# Altium schematic sheet Weight Schematic.SchDoc
size A4
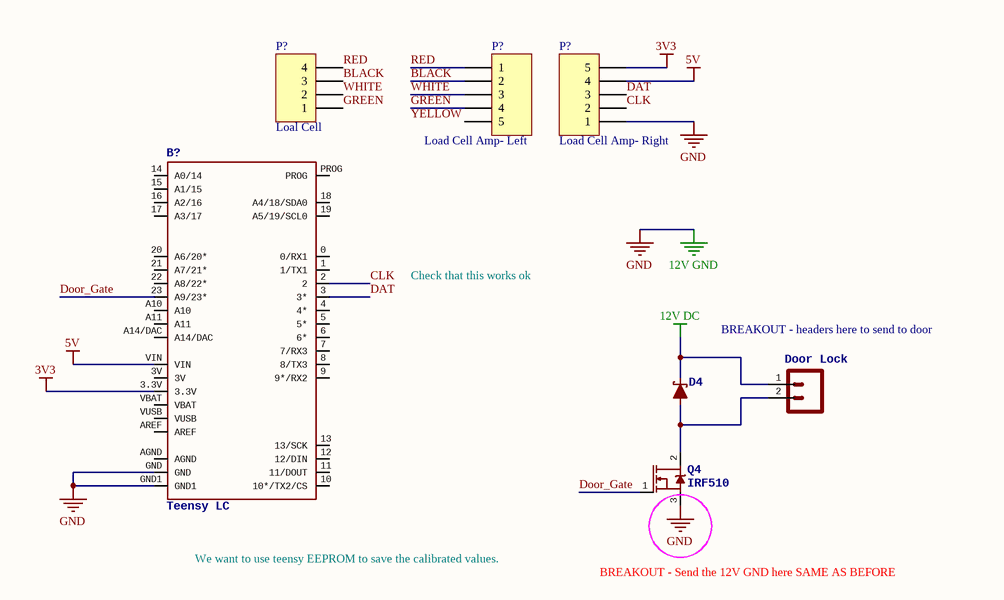
[diagram p0: Weight Schematic.SchDoc]

## Parts
(Parts that share a designator on the sheet are numbered #1, #2 ... from top to bottom, then left to right.)
B?  Teensy LC  [TEENSY-3.1]
D4  (no value)  [SOD-323]
Door_Lock  (no value)  [1X02_LOCK]
P?#1  Load Cell Amp- Left  [HDR1X5]
P?#2  Loal Cell  [HDR1X4]
P?#3  Load Cell Amp- Right  [HDR1X5]
Q4  IRF510  [TO220V]

## Nets
3V3: B?.3.3V P?#3.5
5V: B?.VIN P?#3.4
12V DC: D4.C Door_Lock.1
12V GND: B?.GND B?.GND1 P?#3.1 Q4.3(S)  [also labelled GND]
BLACK: P?#1.2 P?#2.3
CLK: B?.2 P?#3.2
DAT: B?.3(3*) P?#3.3
Door_Gate: B?.23(A9/23*) Q4.1(G)
GREEN: P?#1.4 P?#2.1
RED: P?#1.1 P?#2.4
WHITE: P?#1.3 P?#2.2
NetD4_A: D4.A Door_Lock.2 Q4.2(D)

Not connected (* = marked no-connect by the designer): B? 0(0/RX1) 1(1/TX1) 3V 4(4*) 5(5*) 6(6*) 7(7/RX3) 8(8/TX3) 9(9*/RX2) 10(10*/TX2/CS) 11(11/DOUT) 12(12/DIN) 13(13/SCK) 14(A0/14) 15(A1/15) 16(A2/16) 17(A3/17) 18(A4/18/SDA0) 19(A5/19/SCL0) 20(A6/20*) 21(A7/21*) 22(A8/22*) A10 A11 A14/DAC AGND AREF PROG VBAT VUSB; P?#1 5

## Notes on the sheet
- Check that this works ok
- BREAKOUT - headers here to send to door
- We want to use teensy EEPROM to save the calibrated values.
- BREAKOUT - Send the 12V GND here SAME AS BEFORE
- Labels drawn without touching a wire or pin: YELLOW

## Library data of the parts
B? = TEENSY-3.1SILK: SF_ID: DEV-12646
D4 = DIODE-SCHOTTKY-BAT20J: Schottky diode    A Schottky diode is a semiconductor diode which has a low forward voltage drop and a very fast switching action.; PROD_ID: DIO-11623
Door_Lock = CONN_02LOCK
P?#1 P?#3 = Header 5: Header, 5-Pin; LatestRevisionDate: 17-Jul-2002; LatestRevisionNote: Re-released for DXP Platform.; Publisher: Altium Limited
P?#2 = Header 4: Header, 4-Pin; LatestRevisionDate: 17-Jul-2002; LatestRevisionNote: Re-released for DXP Platform.; Publisher: Altium Limited
Q4 = MOSFET-NCH-FQP30N06L: PROD_ID: TRANS-10060